# Altium project pad_ecg.PrjPcb
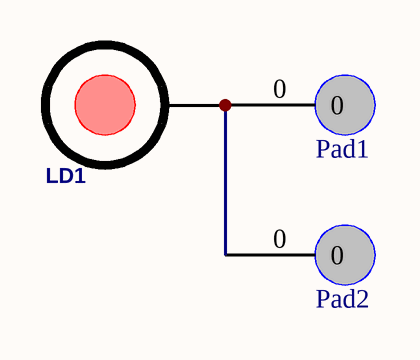
[diagram p0: pad_ecg_schematic.SchDoc]
1 sheet, 3 parts. Net scope: global (net labels, ports and power ports of the same name join across sheets).
Board file: pad_ecg_pcb.PcbDoc

## Sheet pad_ecg_schematic.SchDoc
size A

### Parts
LD1  ECG LEAD  [ECG PAD]  (value not drawn)
Pad1  pad_ecg  [pad_ecg]  (value not drawn)
Pad2  pad_ecg  [pad_ecg]  (value not drawn)

### Nets
NetLD1_1: LD1.1 Pad1.0 Pad2.0